# EAGLE design hello6 (EAGLE 4.11)
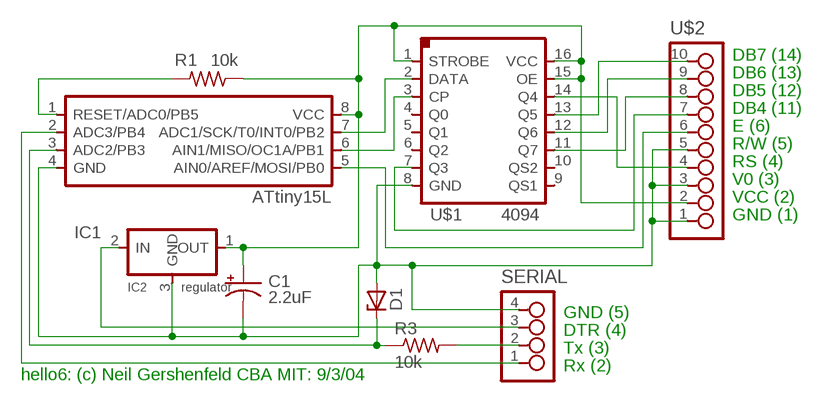
[diagram p0: schematic, sheet 1]

## Parts
C1  2.2uF  CAP_POLARIZEDA3216-18  [A3216-18]
D1  ZENER_DIODESOD123  [SOD123]
IC1  ATtiny15L  ATTINY15LSMT  [SOIC8]
IC2  regulator  REGULATORSOT23  [SOT23]
R1  10k  RESISTOR1206  [1206]
R3  10k  RESISTOR1206  [1206]
SERIAL  4_PIN_HEADERMICRO  [MICRO_4]
U$1  4094SO16  [SO16]
U$2  10_PIN_HEADERHEADER  [SMT_PINS_10]

## Nets
N$1: C1.+ IC1.8(VCC) IC2.1(OUT) R1.1 U$1.1(STROBE) U$1.15(OE) U$1.16(VCC) U$2.2
N$2: C1.- D1.ANODE IC1.4(GND) IC2.3(GND) SERIAL.4 U$1.8(GND) U$2.1 U$2.3 U$2.5
N$3: IC2.2(IN) SERIAL.3
N$4: IC1.7(ADC1/SCK/T0/INT0/PB2) U$1.2(DATA)
N$5: IC1.6(AIN1/MISO/OC1A/PB1) U$1.3(CP)
N$6: IC1.1(RESET/ADC0/PB5) R1.2
N$7: U$1.7(Q3) U$2.7
N$8: D1.CATHODE IC1.3(ADC2/PB3) R3.1
N$11: R3.2 SERIAL.2
N$12: IC1.2(ADC3/PB4) SERIAL.1
N$13: U$1.11(Q7) U$2.8
N$14: U$1.12(Q6) U$2.9
N$15: U$1.13(Q5) U$2.10
N$16: U$1.14(Q4) U$2.4
N$18: IC1.5(AIN0/AREF/MOSI/PB0) U$2.6
Unconnected: U$1.4(Q0) U$1.5(Q1) U$1.6(Q2) U$1.9(QS1) U$1.10(QS2)

## Notes on the sheet
- DB7 (14)
- DB6 (13)
- DB5 (12)
- DB4 (11)
- E (6)
- R/W (5)
- RS (4)
- V0 (3)
- VCC (2)
- GND (1)
- GND (5)
- DTR (4)
- Tx (3)
- Rx (2)
- hello6: (c) Neil Gershenfeld CBA MIT: 9/3/04

## Library data of the parts
C1 = ng:CAP_POLARIZED
D1 = ng:ZENER_DIODE: zener diode
IC1 = ng:ATTINY15L: Atmel ATtiny15L
IC2 = ng:REGULATOR
R1 R3 = ng:RESISTOR
SERIAL = ng:4_PIN_HEADER: 4 SMT pin pads
U$1 = ng:4094
U$2 = ng:10_PIN_HEADER

## Board
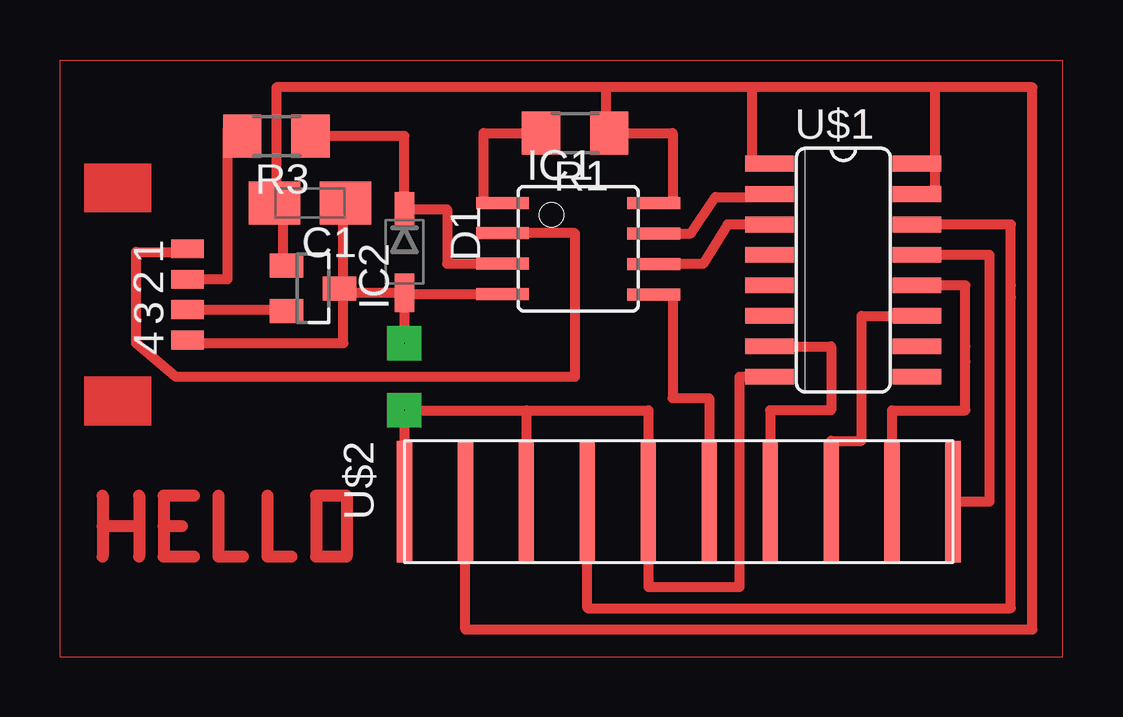
[diagram p1: board, top side]
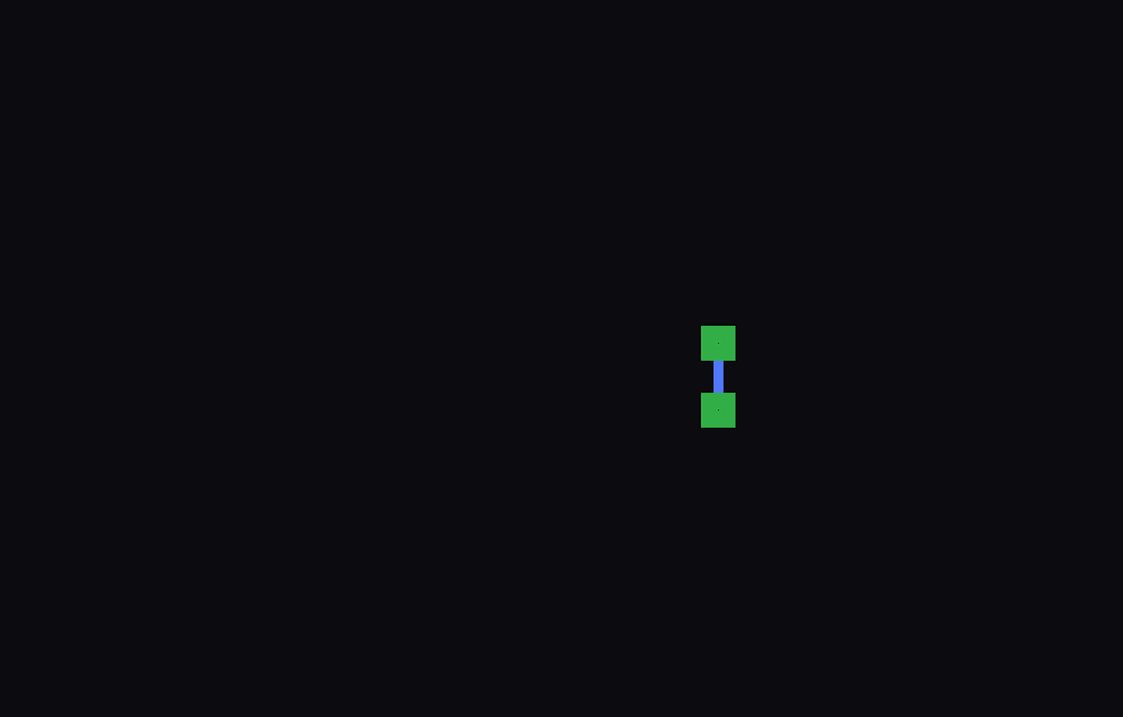
[diagram p2: board, bottom side, seen from below]

No outline drawn. Coordinates in mm, seen from the top.
Copper layers (1*16): Top 0.035mm / dielectric 1.5mm / Bottom 0.035mm
Design rules "default": minimum track width 10mil, minimum drill 24mil, track to track 8mil, track to pad 8mil, pad to pad 8mil, via to via 8mil, smd to smd 8mil, copper to edge 40mil, drill to drill 8mil, minimum pad ring 10mil, minimum via ring 8mil, stop-mask expansion 4mil, vias tented up to drill 0mil, thermal gap 10mil

### Footprints (pad centres in the part's own frame; a part is rotated, then mirrored left to right if it is on the bottom)
A3216-18 = smd 2.15 x 1.8: + 1.475,0; - -1.475,0
SOD123 = smd 1.6 x 0.8: ANODE 1.7,0; CATHODE -1.7,0
SOIC8 = smd 0.5 x 2.2: 1 -1.905,-3.154; 2 -0.645,-3.154; 3 0.625,-3.154; 4 1.895,-3.154; 5 1.905,3.154; 6 0.635,3.154; 7 -0.635,3.154; 8 -1.905,3.154
SOT23 = smd 1 x 1.4: 1 -0.95,-1.1; 2 0.95,-1.1; 3 0,1.1
1206 = smd 1.6 x 1.803: 1 -1.422,0; 2 1.422,0
MICRO_4 = smd 0.787 x 1.346: 1 -1.905,1.626; 2 -0.635,1.626; 3 0.635,1.626; 4 1.905,1.626
SO16 = smd 0.66 x 2.032: 1 -4.445,-3.073; 2 -3.175,-3.073; 3 -1.905,-3.073; 4 -0.635,-3.073; 5 0.635,-3.073; 6 1.905,-3.073; 7 3.175,-3.073; 8 4.445,-3.073; 9 4.445,3.073; 10 3.175,3.073; 11 1.905,3.073; 12 0.635,3.073; 13 -0.635,3.073; 14 -1.905,3.073; 15 -3.175,3.073; 16 -4.445,3.073
SMT_PINS_10 = smd 5.08 x 0.635: 1 0,0; 2 0,2.54; 3 0,5.08; 4 0,7.62; 5 0,10.16; 6 0,12.7; 7 0,15.24; 8 0,17.78; 9 0,20.32; 10 0,22.86

### Placement (x,y rotation side)
C1  10.54,10.16 180 top
D1  14.48,8.13 270 top
IC1  21.72,8.26 270 top
IC2  10.67,6.6 270 top
R1  21.59,13.08 180 top
R3  9.14,12.95 180 top
SERIAL  3.81,6.35 270 top
U$1  32.77,7.37 270 top
U$2  14.48,-2.29 270 top

### Tracks (layer width: path | path; a pad name or v marks a point on that pad's centre or on a via)
N$1
  Top 0.406: IC2.1 9.4,7.55 9.4,10.16 C1.+ 9.14,10.16 9.14,14.99 22.86,14.99 | 24.13,10.16 IC1.8 25.65,10.16 25.65,13.08 R1.1 22.86,13.08 22.86,14.99 | U$1.1 28.96,11.81 28.96,14.99 | 28.96,14.99 22.86,14.99 | 36.58,14.99 28.96,14.99 | U$1.15 36.58,10.54 36.58,11.81 | 36.58,11.81 U$1.16 | U$2.2 17.02,-7.62 40.64,-7.62 40.64,14.99 36.58,14.99 | 36.58,14.99 36.58,11.81
N$2  (via drill 0.03 pad 1.42)
  Top 0.406: 5.59,4.45 5.59,4.57 | 5.59,4.45 SERIAL.4 5.33,4.45 5.33,4.32 11.94,4.32 11.94,6.43 11.68,6.43 | 5.59,4.45 5.59,4.32 | D1.ANODE 14.48,6.36 | 14.48,6.36 IC1.4 | 14.48,6.36 14.48,6.35 | 11.68,6.43 D1.ANODE | 11.68,6.43 11.68,6.6 IC2.3 11.94,6.6 11.94,10.16 C1.- | D1.ANODE v14.48,4.32 | U$2.1 v14.48,1.52 19.56,1.52 | U$1.8 28.45,2.92 28.45,-5.84 24.64,-5.84 U$2.5 24.64,1.52 19.56,1.52 | 19.56,1.52 U$2.3
  Bottom 0.406: v14.48,4.32 v14.48,1.52
N$3
  Top 0.406: 9.4,5.59 9.4,5.65 | 9.4,5.65 IC2.2 | SERIAL.3 9.4,5.71 9.4,5.65
N$4
  Top 0.406: IC1.7 26.42,8.89 27.43,10.41 29.72,10.41 29.72,10.54 | 29.72,10.67 29.72,10.54 | 29.72,10.54 U$1.2
N$5
  Top 0.406: U$1.3 27.94,9.27 26.92,7.62 IC1.6
N$6
  Top 0.406: IC1.1 17.78,10.16 17.78,13.08 R1.2
N$7
  Top 0.406: U$1.7 32.26,4.19 32.26,1.52 29.72,1.52 U$2.7
N$8
  Top 0.406: 14.48,9.65 D1.CATHODE 14.48,9.91 | R3.1 14.48,12.95 14.48,9.91 | 14.48,9.91 14.48,9.4 | IC1.3 16.26,7.63 16.26,9.91 14.48,9.91
N$10
  Top 0: 0.13,-8.76 0.13,16.13 41.91,16.13 41.91,-8.76 0.13,-8.76
N$11
  Top 0.406: SERIAL.2 7.11,6.99 7.11,13.21 R3.2
N$12
  Top 0.406: 5.33,8.26 5.33,8.38 | 5.33,8.26 SERIAL.1 | 5.33,8.26 5.33,8.13 3.3,8.13 3.3,4.32 4.95,2.92 21.59,2.92 21.59,8.9 IC1.2
N$13
  Top 0.406: 33.53,2.29 33.53,0.25 32.26,0.25 U$2.8 | 33.53,2.29 33.53,2.92 | U$1.11 33.53,5.46 33.53,2.29
N$14
  Top 0.406: 37.85,3.56 37.85,1.52 34.8,1.52 U$2.9 34.8,-2.54 | 37.85,3.56 37.85,4.19 | U$1.12 37.85,6.73 37.85,3.56
N$15
  Top 0.406: 38.86,4.83 38.86,-2.29 U$2.10 | 38.86,4.83 38.86,5.46 | U$1.13 38.86,8 38.86,4.83
N$16
  Top 0.406: 39.75,6.22 39.75,-6.73 22.1,-6.73 U$2.4 22.1,-2.16 | 39.75,6.22 39.75,6.73 | U$1.14 39.75,9.27 39.75,6.22
N$17
  Top 0.508: 1.91,-3.3 1.91,-4.57 | 1.91,-2.03 1.91,-3.3 | 1.91,-3.3 3.43,-3.3
N$18
  Top 0.406: IC1.5 25.65,6.35 25.65,2.03 27.18,2.03 U$2.6
N$19
  Top 0.508: 3.43,-2.03 3.43,-4.57
N$20
  Top 0.508: 4.45,-3.3 4.45,-2.03 5.71,-2.03 | 4.45,-3.3 4.45,-4.57 5.71,-4.57 | 4.45,-3.3 5.21,-3.3
N$21
  Top 0.508: 6.73,-2.03 6.73,-4.57 7.75,-4.57
N$22
  Top 0.508: 8.76,-2.03 8.76,-4.57 9.78,-4.57
N$23
  Top 0.508: 10.79,-4.57 12.06,-4.57 12.06,-2.03 10.79,-2.03 10.79,-4.57